# EasyEDA Pro project ProDoc_Board1_2025-04-20.epro, board PCB1
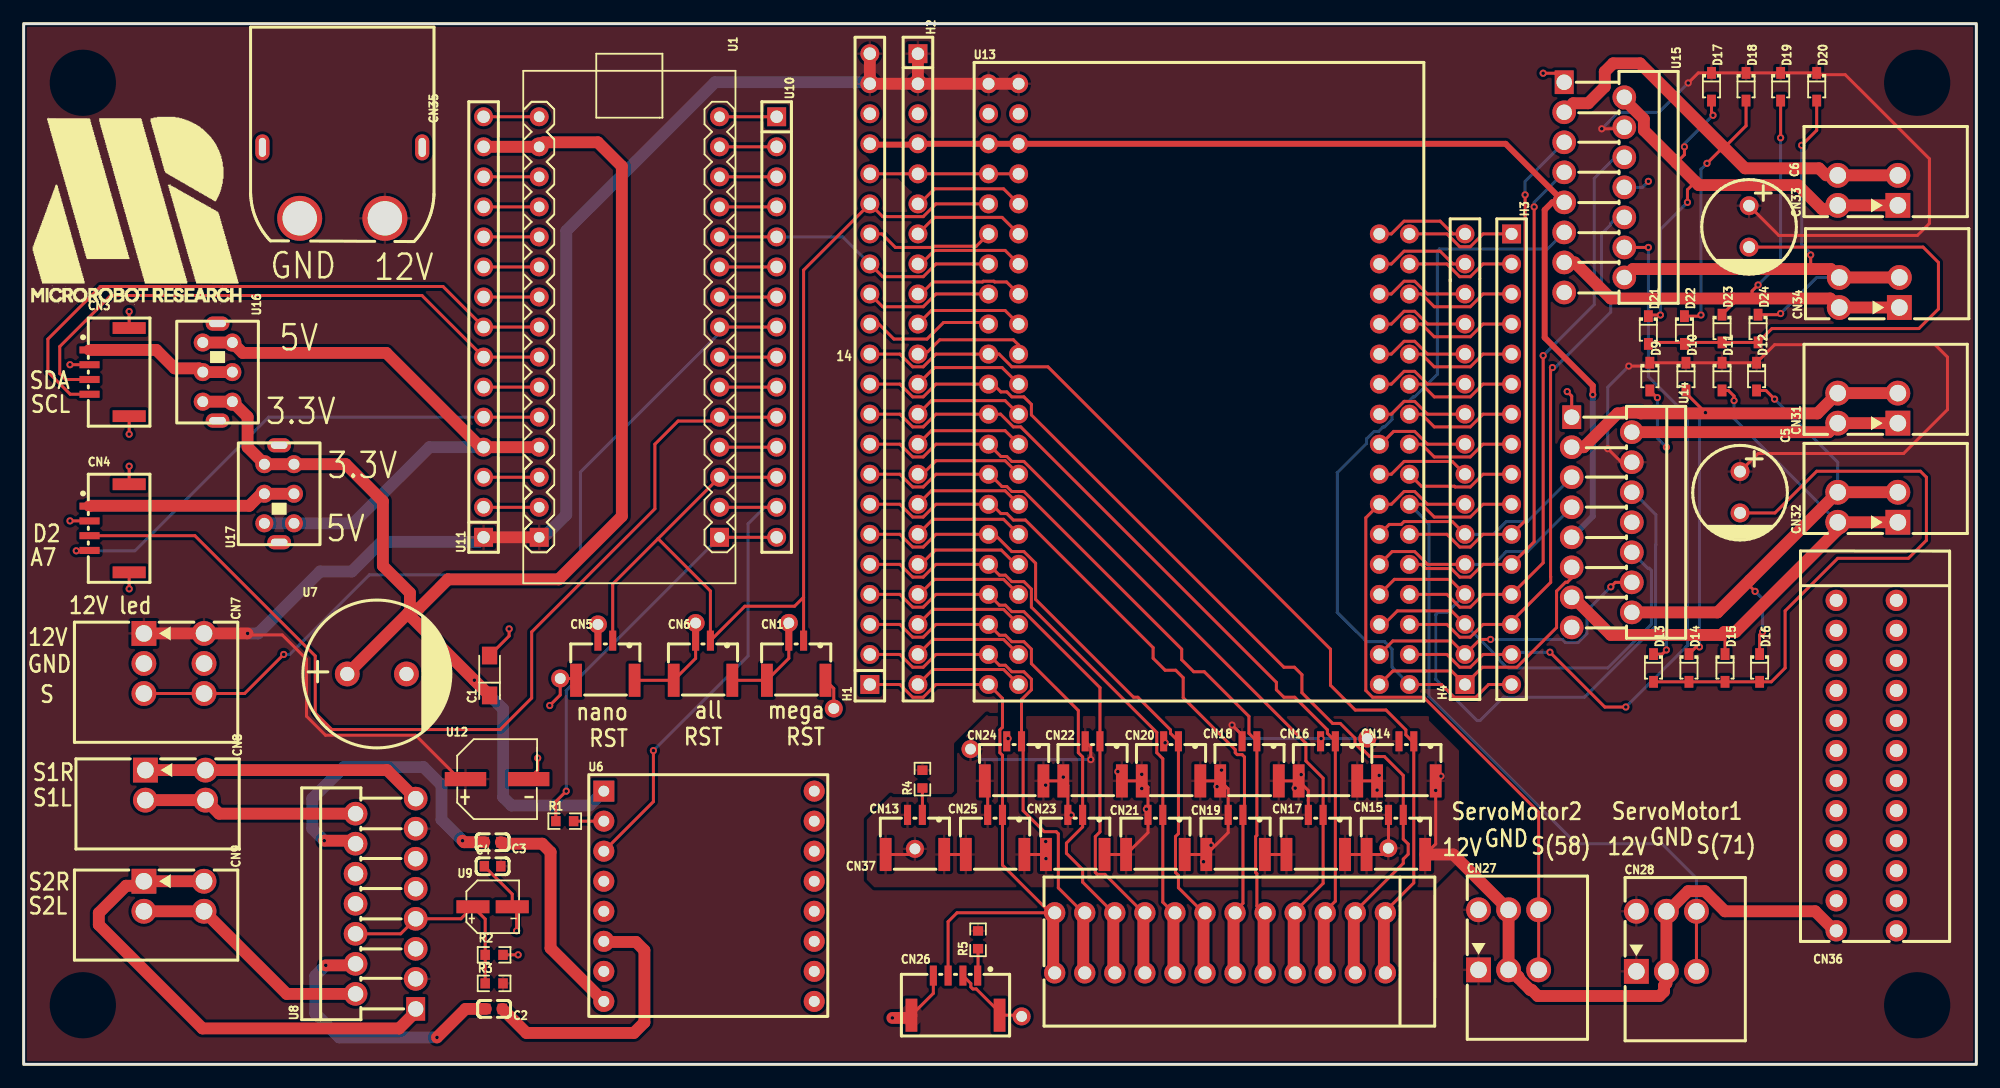
[diagram p2: board, top side]
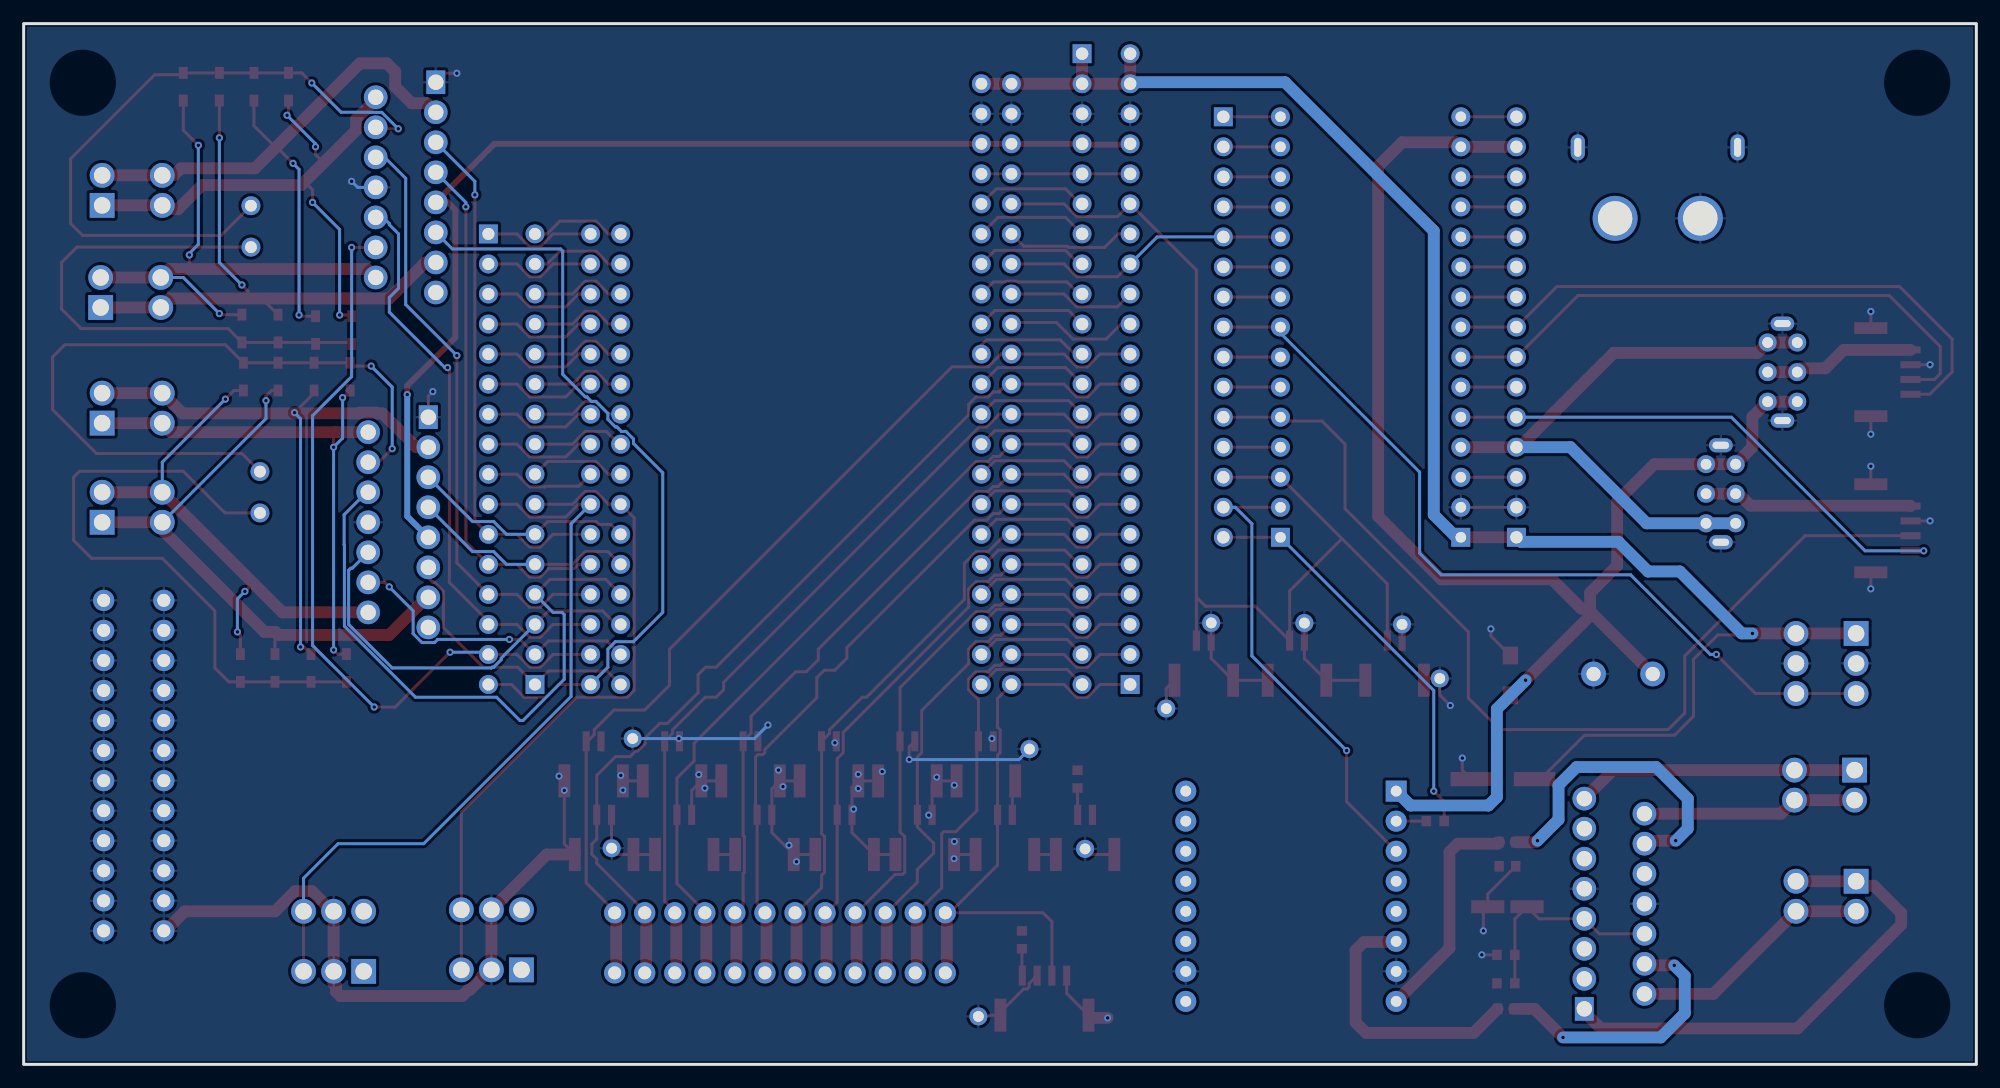
[diagram p3: board, bottom side, seen from below]

Outline 165 x 88 mm; copper layers: Top Layer, Bottom Layer. Coordinates in mm from the lower left corner of the outline.
Outline path: rectangle 0,88 165,0
Stack: Top Layer 0.035mm / Dielectric1 1.51mm FR4 er 4.5 / Bottom Layer 0.035mm

## Design rules (mm)
template: JLCPCB Capability(Two Layers Board)
spacing copperThickness1oz (default): track to track 0.102, other pairs 0.152 to 0.3
spacing copperThickness2oz: track to track 0.203, other pairs 0.152 to 0.3
track width copperThickness1oz (default): min 0.127, default 0.254, max 2.54
track width copperThickness2oz: min 0.203, default 0.254, max 2.54
differential pair differentialPair (default): width min 0.127, default 0.254, max 2.54; gap min 0.152, default 0.152
via viaSize (default): diameter min 0.5, default 0.61, max 10; hole min 0.3, default 0.305, max 6.3

## Placement (name value [footprint] x y rotation side)
C1  100nF  [CAP-SMD_L3.2-W1.6-RD]  39.37 32.88 90 top
C2  220nF  [C0603]  39.75 4.69 180 top
C3  220nF  [C0603]  39.62 18.78 180 top
C4  100nF  [C0603]  39.62 16.75 0 top
C5  220uF  [CAP-TH_BD8.0-P3.50-D0.6-FD]  145.03 48.38 270 top
C6  220uF  [CAP-TH_BD8.0-P3.50-D0.6-FD]  145.8 70.86 270 top
CN3  BM04B-GHS-TBT(LF)(SN)  [CONN-SMD_4P-P1.25_BM04B-GHS-TBT-LF-SN]  7.24 58.54 90 top
CN4  BM04B-GHS-TBT(LF)(SN)  [CONN-SMD_4P-P1.25_BM04B-GHS-TBT-LF-SN]  7.24 45.33 90 top
CN5  BM02B-GHS-TBT(LF)(SN)  [CONN-SMD_2P-P1.25_BM02B-GHS-TBT-LF-SN]  49.15 34.15 0 top
CN6  BM02B-GHS-TBT(LF)(SN)  [CONN-SMD_2P-P1.25_BM02B-GHS-TBT-LF-SN]  57.4 34.15 0 top
CN7  KF141R-2.54-3P  [CONN-TH_3P-P2.54_KF141R-2.54-3P]  12.7 33.9 270 top
CN8  KF141R-2.54-2P  [CONN-TH_2P-P2.54_KF141R-2.54-2P]  12.83 23.61 270 top
CN9  KF141R-2.54-2P  [CONN-TH_2P-P2.54_KF141R-2.54-2P]  12.7 14.21 270 top
CN10  BM02B-GHS-TBT(LF)(SN)  [CONN-SMD_2P-P1.25_BM02B-GHS-TBT-LF-SN]  65.28 34.15 0 top
CN13  BM02B-GHS-TBT(LF)(SN)  [CONN-SMD_2P-P1.25_BM02B-GHS-TBT-LF-SN]  75.31 19.42 0 top
CN14  BM02B-GHS-TBT(LF)(SN)  [CONN-SMD_2P-P1.25_BM02B-GHS-TBT-LF-SN]  116.84 25.64 0 top
CN15  BM02B-GHS-TBT(LF)(SN)  [CONN-SMD_2P-P1.25_BM02B-GHS-TBT-LF-SN]  115.95 19.42 0 top
CN16  BM02B-GHS-TBT(LF)(SN)  [CONN-SMD_2P-P1.25_BM02B-GHS-TBT-LF-SN]  110.21 25.64 0 top
CN17  BM02B-GHS-TBT(LF)(SN)  [CONN-SMD_2P-P1.25_BM02B-GHS-TBT-LF-SN]  109.18 19.42 0 top
CN18  BM02B-GHS-TBT(LF)(SN)  [CONN-SMD_2P-P1.25_BM02B-GHS-TBT-LF-SN]  103.58 25.64 0 top
CN19  BM02B-GHS-TBT(LF)(SN)  [CONN-SMD_2P-P1.25_BM02B-GHS-TBT-LF-SN]  102.4 19.42 0 top
CN20  BM02B-GHS-TBT(LF)(SN)  [CONN-SMD_2P-P1.25_BM02B-GHS-TBT-LF-SN]  96.95 25.64 0 top
CN21  BM02B-GHS-TBT(LF)(SN)  [CONN-SMD_2P-P1.25_BM02B-GHS-TBT-LF-SN]  95.63 19.42 0 top
CN22  BM02B-GHS-TBT(LF)(SN)  [CONN-SMD_2P-P1.25_BM02B-GHS-TBT-LF-SN]  90.32 25.64 0 top
CN23  BM02B-GHS-TBT(LF)(SN)  [CONN-SMD_2P-P1.25_BM02B-GHS-TBT-LF-SN]  88.86 19.42 0 top
CN24  BM02B-GHS-TBT(LF)(SN)  [CONN-SMD_2P-P1.25_BM02B-GHS-TBT-LF-SN]  83.69 25.64 0 top
CN25  BM02B-GHS-TBT(LF)(SN)  [CONN-SMD_2P-P1.25_BM02B-GHS-TBT-LF-SN]  82.08 19.42 0 top
CN26  BM04B-GHS-TBT(LF)(SN)  [CONN-SMD_4P-P1.25_BM04B-GHS-TBT-LF-SN]  78.74 5.83 0 top
CN27  KF141R-2.54-3P  [CONN-TH_3P-P2.54_KF141R-2.54-3P]  125.48 10.53 0 top
CN28  KF141R-2.54-3P  [CONN-TH_3P-P2.54_KF141R-2.54-3P]  138.81 10.4 0 top
CN31  KF141R-2.54-2P  [CONN-TH_2P-P2.54_KF141R-2.54-2P]  155.83 55.49 90 top
CN32  KF141R-2.54-2P  [CONN-TH_2P-P2.54_KF141R-2.54-2P]  155.83 47.11 90 top
CN33  KF141R-2.54-2P  [CONN-TH_2P-P2.54_KF141R-2.54-2P]  155.83 73.9 90 top
CN34  KF141R-2.54-2P  [CONN-TH_2P-P2.54_KF141R-2.54-2P]  155.96 65.27 90 top
CN35  XT60PW-M  [CONN-TH_XT60PW-M]  26.92 74.54 270 top
CN36  DB141R-2.54-12P-GN  [CONN-TH_12P-P2.54_DIBO_DB141R-2.54-12P]  155.7 25.26 90 top
CN37  DB141R-2.54-12P-GN  [CONN-TH_12P-P2.54_DIBO_DB141R-2.54-12P]  101.09 10.28 0 top
D9  1N5819WS  [SOD-323_L1.8-W1.3-LS2.5-RD]  137.41 58.16 270 top
D10  1N5819WS  [SOD-323_L1.8-W1.3-LS2.5-RD]  140.46 58.16 270 top
D11  1N5819WS  [SOD-323_L1.8-W1.3-LS2.5-RD]  143.51 58.16 270 top
D12  1N5819WS  [SOD-323_L1.8-W1.3-LS2.5-RD]  146.43 58.16 270 top
D13  1N5819WS  [SOD-323_L1.8-W1.3-LS2.5-RD]  137.72 33.52 270 top
D14  1N5819WS  [SOD-323_L1.8-W1.3-LS2.5-RD]  140.72 33.52 270 top
D15  1N5819WS  [SOD-323_L1.8-W1.3-LS2.5-RD]  143.76 33.52 270 top
D16  1N5819WS  [SOD-323_L1.8-W1.3-LS2.5-RD]  146.69 33.52 270 top
D17  1N5819WS  [SOD-323_L1.8-W1.3-LS2.5-RD]  142.62 82.67 270 top
D18  1N5819WS  [SOD-323_L1.8-W1.3-LS2.5-RD]  145.54 82.67 270 top
D19  1N5819WS  [SOD-323_L1.8-W1.3-LS2.5-RD]  148.46 82.67 270 top
D20  1N5819WS  [SOD-323_L1.8-W1.3-LS2.5-RD]  151.51 82.67 270 top
D21  1N5819WS  [SOD-323_L1.8-W1.3-LS2.5-RD]  137.29 62.09 270 top
D22  1N5819WS  [SOD-323_L1.8-W1.3-LS2.5-RD]  140.34 62.09 270 top
D23  1N5819WS  [SOD-323_L1.8-W1.3-LS2.5-RD]  143.51 62.22 270 top
D24  1N5819WS  [SOD-323_L1.8-W1.3-LS2.5-RD]  146.56 62.22 270 top
H1  PZ254V-11-22P  [HDR-TH_22P-P2.54-V-M]  71.5 58.79 90 top
H2  PZ254V-11-22P  [HDR-TH_22P-P2.54-V-M]  75.56 58.79 270 top
H3  PZ254V-11-16P  [HDR-TH_PZ254V-11-16P]  125.73 51.17 270 top
H4  PZ254V-11-16P  [HDR-TH_PZ254V-11-16P]  121.79 51.17 90 top
NOREF  -  [Pad_e653]  56.78 37.32 0 top
NOREF#2  -  [Pad_e2172]  75.31 18.22 0 top
NOREF#3  -  [Pad_e2170]  113.54 27.55 0 top
NOREF#4  -  [Pad_e655]  45.34 32.63 0 top
NOREF#5  -  [Pad_e2171]  115.32 18.28 0 top
NOREF#6  -  [Pad_e651]  68.45 30.09 0 top
NOREF#7  -  [Pad_e654]  48.52 37.2 0 top
NOREF#8  -  [Pad_e652]  64.65 37.33 0 top
NOREF#9  -  [Pad_e2168]  80.01 26.66 0 top
NOREF#10  -  [Pad_e2173]  84.33 4.05 0 top
R1  1kF/1608/(1/10W)  [R0603]  45.72 20.56 0 top
R2  47kΩ  [R0603]  39.75 9.26 180 top
R3  47kΩ  [R0603]  39.75 6.85 0 top
R4  10kΩ  [R0603]  75.95 24.12 90 top
R5  10kΩ  [R0603]  80.65 10.53 90 top
U1  ARDUINO_NANO  [COMM-TH_ARDUINO_NANO]  51.18 62.35 270 top
U6  -  [DFplayer]  49.02 23.1 0 top
U7  1000uF  [CAP-TH_BD12.5-P5.00-D0.6-FD]  29.84 33.01 0 top
U8  TDA7297  [MULTIWATT-15_L19.6-W5.0-P1.27-L]  30.58 13.58 90 top
U9  10uF  [CAP-SMD_BD4.0-L4.3-W4.3-LS5.0-FD]  39.62 13.32 0 top
U10  PZ254V-11-15P  [HDR-TH_15P-P2.54-V-M]  63.63 62.35 270 top
U11  PZ254V-11-15P  [HDR-TH_15P-P2.54-V-M]  38.86 62.35 90 top
U12  470uF  [CAP-SMD_BD6.3-L6.6-W6.6-LS7.2-FD]  40 24.12 0 top
U13  ARD_MEGA2560PRO  [COMM-SMD_L54.0-W38.0-P2.54_ARD_MEGA2560PRO]  99.31 57.52 0 top
U14  L298N  [MULTIWATT-15_L19.6-W5.0-P1.27-L]  133.35 45.84 270 top
U15  L298N  [MULTIWATT-15_L19.6-W5.0-P1.27-L]  132.72 74.16 270 top
U16  KH-SS22D07-VG4H  [SW-TH_KH-SS22D07-VG4H]  16.38 58.54 270 top
U17  KH-SS22D07-VG4H  [SW-TH_KH-SS22D07-VG4H]  21.59 48.25 90 top

## Footprints (pads in the part's own frame, mm; a bottom-side part is the same pattern mirrored in y, then rotated)
C0603
  rect 0.8x0.9 smd: 1(-0.7,0) 2(0.7,0)
CAP-SMD_BD4.0-L4.3-W4.3-LS5.0-FD
  rect 2.8x1.1 smd: 1(-1.661,0) 2(1.661,0)
CAP-SMD_BD6.3-L6.6-W6.6-LS7.2-FD
  rect 3.5x1.2 smd: 1(-2.67,0) 2(2.67,0)
CAP-SMD_L3.2-W1.6-RD
  rect 1.5x1.296 smd: 1(-1.687,0) 2(1.687,0)
CAP-TH_BD8.0-P3.50-D0.6-FD
  round 1.6 hole 1: 1(-1.75,0) 2(1.75,0)
CAP-TH_BD12.5-P5.00-D0.6-FD
  round 2.1 hole 1.2: 1(-2.5,0) 2(2.5,0)
COMM-SMD_L54.0-W38.0-P2.54_ARD_MEGA2560PRO
  round 1.6 hole 1: 1(-17.78,25.4) 2(-17.78,22.86) 3(-17.78,20.32) 4(-17.78,17.78) 5(-17.78,15.24) 6(-17.78,12.7) 7(-17.78,10.16) 8(-17.78,7.62) 9(-17.78,5.08) 10(-17.78,2.54) 11(-17.78,0) 12(-17.78,-2.54) 13(-17.78,-5.08) 14(-17.78,-7.62) 15(-17.78,-10.16) 16(-17.78,-12.7) 17(-17.78,-15.24) 18(-17.78,-17.78) 19(-17.78,-20.32) 20(-17.78,-22.86) 21(-17.78,-25.4) 22(-15.24,-25.4) 23(-15.24,-22.86) 24(-15.24,-20.32) 25(-15.24,-17.78) 26(-15.24,-15.24) 27(-15.24,-12.7) 28(-15.24,-10.16) 29(-15.24,-7.62) 30(-15.24,-5.08) 31(-15.24,-2.54) 32(-15.24,0) 33(-15.24,2.54) 34(-15.24,5.08) 35(-15.24,7.62) 36(-15.24,10.16) 37(-15.24,12.7) 38(-15.24,15.24) 39(-15.24,17.78) 40(-15.24,20.32) 41(-15.24,22.86) 42(-15.24,25.4) 49(15.24,12.7) 50(15.24,10.16) 51(15.24,7.62) 52(15.24,5.08) 53(15.24,2.54) 54(15.24,0) 55(15.24,-2.54) 56(15.24,-5.08) 57(15.24,-7.62) 58(15.24,-10.16) 59(15.24,-12.7) 60(15.24,-15.24) 61(15.24,-17.78) 62(15.24,-20.32) 63(15.24,-22.86) 64(15.24,-25.4) 65(17.78,-25.4) 66(17.78,-22.86) 67(17.78,-20.32) 68(17.78,-17.78) 69(17.78,-15.24) 70(17.78,-12.7) 71(17.78,-10.16) 72(17.78,-7.62) 73(17.78,-5.08) 74(17.78,-2.54) 75(17.78,0) 76(17.78,2.54) 77(17.78,5.08) 78(17.78,7.62) 79(17.78,10.16) 80(17.78,12.7)
COMM-TH_ARDUINO_NANO
  rect 1.6x1.6 hole 0.9: 1(17.78,7.62) 30(17.78,-7.62)
  round 1.6 hole 0.9: 2(15.24,7.62) 3(12.7,7.62) 4(10.16,7.62) 5(7.62,7.62) 6(5.08,7.62) 7(2.54,7.62) 8(0,7.62) 9(-2.54,7.62) 10(-5.08,7.62) 11(-7.62,7.62) 12(-10.16,7.62) 13(-12.7,7.62) 14(-15.24,7.62) 15(-17.78,7.62) 16(-17.78,-7.62) 17(-15.24,-7.62) 18(-12.7,-7.62) 19(-10.16,-7.62) 20(-7.62,-7.62) 21(-5.08,-7.62) 22(-2.54,-7.62) 23(0,-7.62) 24(2.54,-7.62) 25(5.08,-7.62) 26(7.62,-7.62) 27(10.16,-7.62) 28(12.7,-7.62) 29(15.24,-7.62)
CONN-SMD_2P-P1.25_BM02B-GHS-TBT-LF-SN
  rect 0.6x1.7 smd: 1(0.625,1.675) 2(-0.625,1.675)
  rect 1x2.8 smd: 3(2.475,-1.675) 4(-2.475,-1.675)
CONN-SMD_4P-P1.25_BM04B-GHS-TBT-LF-SN
  rect 0.6x1.7 smd: 1(1.875,1.675) 2(0.625,1.675) 3(-0.625,1.675) 4(-1.875,1.675)
  rect 1x2.8 smd: 5(3.725,-1.675) 6(-3.725,-1.675)
CONN-TH_2P-P2.54_KF141R-2.54-2P
  round 2.1 hole 1.4: 1(-1.27,2.54) 2(1.27,2.54) 2(1.27,-2.54)
  rect 2.1x2.1 hole 1.4: 1(-1.27,-2.54)
CONN-TH_3P-P2.54_KF141R-2.54-3P
  round 2.1 hole 1.4: 1(-2.54,2.54) 2(0,2.54) 2(0,-2.54) 3(2.54,2.54) 3(2.54,-2.54)
  rect 2.1x2.1 hole 1.4: 1(-2.54,-2.54)
CONN-TH_12P-P2.54_DIBO_DB141R-2.54-12P
  round 1.8 hole 1.1: 1(-13.97,2.54) 1(-13.97,-2.54) 2(-11.43,2.54) 2(-11.43,-2.54) 3(-8.89,2.54) 3(-8.89,-2.54) 4(-6.35,2.54) 4(-6.35,-2.54) 5(-3.81,2.54) 5(-3.81,-2.54) 6(-1.27,2.54) 6(-1.27,-2.54) 7(1.27,2.54) 7(1.27,-2.54) 8(3.81,2.54) 8(3.81,-2.54) 9(6.35,2.54) 9(6.35,-2.54) 10(8.89,2.54) 10(8.89,-2.54) 11(11.43,2.54) 11(11.43,-2.54) 12(13.97,2.54) 12(13.97,-2.54)
CONN-TH_XT60PW-M
  round 3.8 hole 2.9: 1(3,-3.6) 2(3,3.6)
  oval 2.2x1.2 hole 1.6x0.6: 3(-3,6.75) 4(-3,-6.75)
DFplayer
  rect 1.778x1.778 hole 0.914: 1(0,0)
  round 1.778 hole 0.914: 2(0,-2.54) 3(0,-5.08) 4(0,-7.62) 5(0,-10.16) 6(0,-12.7) 7(0,-15.24) 8(0,-17.78) 9(17.78,-17.78) 10(17.78,-15.24) 11(17.78,-12.7) 12(17.78,-10.16) 13(17.78,-7.62) 14(17.78,-5.08) 15(17.78,-2.54) 16(17.78,0)
HDR-TH_15P-P2.54-V-M
  rect 1.6x1.6 hole 1.05: 1(-17.78,0)
  round 1.6 hole 1.05: 2(-15.24,0) 3(-12.7,0) 4(-10.16,0) 5(-7.62,0) 6(-5.08,0) 7(-2.54,0) 8(0,0) 9(2.54,0) 10(5.08,0) 11(7.62,0) 12(10.16,0) 13(12.7,0) 14(15.24,0) 15(17.78,0)
HDR-TH_22P-P2.54-V-M
  rect 1.6x1.6 hole 1.05: 1(-26.67,0)
  round 1.6 hole 1.05: 2(-24.13,0) 3(-21.59,0) 4(-19.05,0) 5(-16.51,0) 6(-13.97,0) 7(-11.43,0) 8(-8.89,0) 9(-6.35,0) 10(-3.81,0) 11(-1.27,0) 12(1.27,0) 13(3.81,0) 14(6.35,0) 15(8.89,0) 16(11.43,0) 17(13.97,0) 18(16.51,0) 19(19.05,0) 20(21.59,0) 21(24.13,0) 22(26.67,0)
HDR-TH_PZ254V-11-16P
  rect 1.6x1.6 hole 1.02: 1(-19.05,0)
  round 1.6 hole 1.02: 2(-16.51,0) 3(-13.97,0) 4(-11.43,0) 5(-8.89,0) 6(-6.35,0) 7(-3.81,0) 8(-1.27,0) 9(1.27,0) 10(3.81,0) 11(6.35,0) 12(8.89,0) 13(11.43,0) 14(13.97,0) 15(16.51,0) 16(19.05,0)
MULTIWATT-15_L19.6-W5.0-P1.27-L
  rect 2x1.6 hole 1.3: 1(-8.89,-2.54)
  round 2 hole 1.3: 2(-7.62,2.54) 3(-6.35,-2.54) 4(-5.08,2.54) 5(-3.81,-2.54) 6(-2.54,2.54) 7(-1.27,-2.54) 8(0,2.54) 9(1.27,-2.54) 10(2.54,2.54) 11(3.81,-2.54) 12(5.08,2.54) 13(6.35,-2.54) 14(7.62,2.54) 15(8.89,-2.54)
Pad_e651
  round 1.524 hole 0.914: 1(0,0)
Pad_e652
  round 1.524 hole 0.914: 2(0,0)
Pad_e653
  round 1.524 hole 0.914: 3(0,0)
Pad_e654
  round 1.524 hole 0.914: 4(0,0)
Pad_e655
  round 1.524 hole 0.914: 5(0,0)
Pad_e2168
  round 1.524 hole 0.914: 1(0,0)
Pad_e2170
  round 1.524 hole 0.914: 3(0,0)
Pad_e2171
  round 1.524 hole 0.914: 4(0,0)
Pad_e2172
  round 1.524 hole 0.914: 5(0,0)
Pad_e2173
  round 1.524 hole 0.914: 6(0,0)
R0603
  rect 0.806x0.864 smd: 1(-0.753,0) 2(0.753,0)
SOD-323_L1.8-W1.3-LS2.5-RD
  rect 1x0.75 smd: 1(-1.173,0) 2(1.173,0)
SW-TH_KH-SS22D07-VG4H
  round 1.524 hole 0.914: 1(-2.5,-1.25) 2(0,-1.25) 3(2.5,-1.25) 4(-2.5,1.25) 5(0,1.25) 6(2.5,1.25)
  oval 1.2x2 hole 0.6x1.4: 7(4.1,0) 8(-4.1,0)

## Nets
As in the schematic, except:
GND: C1.2 C4.1 CN3.2 CN3.5 CN3.6 CN4.2 CN4.5 CN4.6 CN5.2 CN5.3 CN5.4 CN6.2 CN6.3 CN6.4 CN7.2 CN10.2 CN10.3 CN10.4 CN13.2 CN13.3 CN13.4 CN14.2 CN14.3 CN14.4 CN15.2 CN15.3 CN15.4 CN16.2 CN16.3 CN16.4 CN17.2 CN17.3 CN17.4 CN18.2 CN18.3 CN18.4 CN19.2 CN19.3 CN19.4 CN20.2 CN20.3 CN20.4 CN21.2 CN21.3 CN21.4 CN22.2 CN22.3 CN22.4 CN23.2 CN23.3 CN23.4 CN24.2 CN24.3 CN24.4 CN25.2 CN25.3 CN25.4 CN26.2 CN26.4 CN26.5 CN26.6 CN27.2 CN28.2 CN35.1 CN35.3 CN35.4 CN36.1 CN36.2 CN36.3 CN36.4 CN36.5 CN36.6 CN36.7 CN36.8 CN36.9 CN36.10 CN36.11 CN36.12 H1.20 H2.3 NOREF.3 NOREF#2.5 NOREF#3.3 NOREF#4.5 NOREF#5.4 NOREF#6.1 NOREF#7.4 NOREF#8.2 NOREF#9.1 NOREF#10.6 R2.1 U1.29 U6.7 U6.10 U7.2 U8.8 U8.9 U9.2 U11.2 U12.2 U13.2 U13.41 U14.1 U14.8 U15.1 U15.8 U16.7 U16.8 U17.7 U17.8

Pads without a net: U6 4 5 9 11 12 13 14 15 16; U8 5 10 11; U14 15; U15 15

## Via types
v1: diameter 0.61, hole 0.305, Top Layer to Bottom Layer, 83 vias

## Routing (per net, layer and track width the routed paths; a pad name or vN(x,y) marks a point on that pad's centre or on a via; arc(x,y) is an arc through that point)
+3.3V: length 131.1
  Top Layer w1: C1.1 v1(38.08,32.48) 32.49,38.07 32.49,38.16 ; U16.3 U16.6 18.92,54.75 18.92,52.19 20.36,50.75 U17.3 27.22,50.75 30.35,47.61 30.35,42.15 32.64,39.87 32.64,38.72 ; 32.49,38.16 U7.1 ; 32.49,38.16 32.88,38.54 33.38,38.54 35.85,41.01 45.21,41.01 50.55,46.34 50.55,75.94 48.51,77.97 43.94,77.97 U1.17 U11.14
  Bottom Layer w1: U6.1 47.81,21.89 41.22,21.89 40.51,22.59 40.51,30.05 v1(38.08,32.48)
+5V: length 146
  Top Layer w0.5: 71.57,77.77 75.5,77.77 H2.4 U13.3 U13.40 125.22,77.84 U15.9 129.16,72.89 128.52,72.25 128.52,61.46 132.59,57.39 v1(132.59,56.63)
  Top Layer w1: U16.1 U16.4 18.51,60.16 30.64,60.16 38.61,52.19 U11.4 U1.27
  Bottom Layer w0.5: v1(132.59,56.63) 132.59,46.34 U14.9
  Bottom Layer w1: U11.4 34.29,52.19 27.85,45.75 U17.1 U17.4
GND: length 206.3
  Top Layer w0.254: CN15.3 119.31,18.63 v1(119.31,23.16) CN14.3 ; 108.55,21.09 108.55,23.15 CN16.4 CN18.3 ; CN25.4 CN13.3 ; CN22.2 90.17,26.85 v1(90.17,25.77) ; U15.1 129.41,83.81 v1(128.4,83.81) ; CN5.3 CN6.4 56.78,34.33 CN6.2 NOREF.3 56.77,37.33 ; CN14.4 CN16.3 ; R2.1 v1(41.78,9.26) ; v1(41.66,11.29) 41.66,12.95 U9.2 41.28,14.39 C4.1 ; NOREF#10.6 84.22,4.16 CN26.5 82.47,4.41 80.49,6.38 80.2,6.38 80.04,6.54 80.04,6.84 CN26.2 ; CN17.4 CN19.3 ; v1(44.45,30.34) 45.34,31.23 NOREF#4.5 46.52,32.63 CN5.4 ; CN23.4 CN25.3 ; CN19.4 101.78,19.6 101.78,23.29 CN18.4 CN20.3 ; CN18.2 102.96,27.84 v1(102.11,28.69) ; CN21.3 99.93,17.75 ; CN24.3 CN22.4 88.23,23.58 88.23,21.09 ; NOREF#6.1 68.45,31.78 CN10.3 ; CN4.2 v1(3.91,45.95) ; NOREF#8.2 CN10.2 64.65,34.33 CN10.4 CN6.3 ; CN22.3 CN20.4 95.01,23.44 95.01,19.6 CN21.4 CN23.3 ; v1(43.43,25.9) 43.43,24.88 U12.2 ; C1.2 41.02,36.22 v1(41.02,36.82) ; CN5.2 NOREF#7.4 ; CN26.4 76.87,6.01 CN26.6 ; CN13.4 74.84,17.75 NOREF#2.5 ; U14.1 130.81,56.5 v1(130.43,56.89) ; CN24.4 81.46,23.73 81.46,21.09 ; CN3.5 v1(8.91,63.66) ; CN3.2 v1(3.91,59.16) ; CN3.6 v1(8.91,53.29) ; CN4.6 v1(8.91,40.21) ; 115.33,21.09 115.33,18.29 NOREF#5.4 114.78,17.75 CN15.4 CN17.3 ; CN4.5 v1(8.91,50.58) ; U11.2 U1.29
  Top Layer w1: CN15.3 120.8,17.75 CN27.2 CN27.2 125.73,7.99 126.31,7.41 126.31,7.28 127.31,6.29 127.43,6.29 127.94,5.78 138.23,5.78 138.61,6.16 138.61,6.64 138.81,6.85 CN28.2 138.81,12.94 138.94,12.94 140.65,14.65 142.06,14.65 143.76,12.94 151.38,12.94 153.16,11.16 ; CN26.6 74.78,3.93 v1(73.41,3.93)
  Bottom Layer w0.254: NOREF#3.3 v1(109.63,27.55) 103.25,27.55 v1(102.11,28.69) ; v1(90.17,25.77) 80.9,25.77 NOREF#9.1 ; v1(137.29,74.67) 136.78,74.16 U15.8
  vias: v1(83.19,27.55) v1(86.36,23.61) v1(86.36,18.84) v1(86.38,17.39) v1(87.85,24.29) v1(88.52,21.07) v1(92.46,24.75) v1(94.48,24.52) v1(94.48,23.32) v1(94.87,21.58) v1(96.45,27.19) v1(99.69,17.13) v1(100.33,18.53) v1(100.84,23.48) v1(101.22,24.88) v1(107.44,23.36) v1(107.95,24.5) v1(114.37,23.19) v1(114.54,24.43) v1(119.76,24.37)
VCC: length 258
  Top Layer w0.254: U14.4 135,50.92 v1(133.86,52.06) ; v1(18.92,36.44) 19.05,36.31 21.85,36.31 23.9,34.26 23.9,29.43 25.51,27.83 33.12,27.83 36.83,24.12 U12.1 ; C5.1 146.56,51.65 158.85,51.65 162.56,55.36 162.56,59.81 161.51,60.85 147.96,60.85 D12.1 D11.1 D10.1 D9.1 137.13,59.04 v1(135.64,59.04) ; v1(133.35,79.11) 135.13,79.11 U15.4 ; v1(140.65,82.98) 141.51,83.84 D17.1 D18.1 D19.1 D20.1 151.67,83.68 153.92,83.68 161.04,76.57 161.04,71.11 160.02,70.09 148.31,70.09 C6.1
  Top Layer w1: H2.1 H2.2 ; H2.2 U13.1 U13.42 ; H2.2 H1.21 H1.22 ; U11.1 U1.30 ; v1(18.92,36.44) CN7.1 CN7.1
  Bottom Layer w0.254: v1(133.35,79.11) 134.74,80.5 135.78,80.5 135.79,80.51 138.18,80.51 v1(140.65,82.98) ; v1(133.86,52.06) 133.86,57.27 v1(135.64,59.04)
  Bottom Layer w1: U11.1 38.48,44.19 30.24,44.19 27.73,41.68 25.05,41.68 19.81,36.44 v1(18.92,36.44) ; H1.21 71.37,83.05 58.42,83.05 45.85,70.47 45.85,46.47 43.94,44.57 U1.30
D1_A: length 44.5
  Top Layer w0.254: U13.70 120.27,44.82 121.35,43.74 122.24,43.74 123.32,44.82 H3.11 126.87,45.96 v1(126.87,73.52)
  Bottom Layer w0.254: U15.5 126.87,74.67 v1(126.87,73.52)
D1_B: length 44.5
  Top Layer w0.254: v1(127.63,72.51) 127.63,44.19 H3.12 123.32,42.28 122.24,41.2 121.35,41.2 120.62,41.92 118.47,41.92 118.12,42.28 U13.69
  Bottom Layer w0.254: 130.18,75.43 127.63,72.89 v1(127.63,72.51)
D1_S: length 50.9
  Top Layer w0.254: v1(128.4,59.93) 128.4,42.41 H3.13 123.32,39.74 122.24,38.66 121.35,38.66 120.27,39.74 U13.68
  Bottom Layer w0.254: v1(128.4,59.93) 132.72,64.25 132.72,74.92 134.49,76.7 U15.6
D2_A: length 49.2
  Top Layer w0.254: v1(129.18,58.92) 129.02,58.76 129.02,41.24 129.03,41.23 129.03,40.76 125.73,37.45 H3.14 123.32,37.2 122.24,36.12 121.35,36.12 120.27,37.2 U13.67
  Bottom Layer w0.254: U15.10 135.13,71.74 134.75,71.74 134.1,71.1 134.1,71 133.32,70.23 133.32,65.62 134.1,64.84 134.1,63.61 129.41,58.92 v1(129.18,58.92)
D2_B: length 65.6
  Top Layer w0.254: H3.15 123.32,34.66 122.24,33.58 121.35,33.58 120.27,34.66 U13.66 ; v1(128.97,34.85) 133.6,30.22 v1(135.38,30.22) ; U15.12 v1(137.29,69.08)
  Bottom Layer w0.254: v1(128.97,34.85) 125.92,34.85 H3.15 ; v1(135.38,30.22) 140.59,35.42 140.59,54.85 137.29,58.16 v1(137.29,69.08)
D2_S: length 65.1
  Top Layer w0.254: H3.16 123.79,32.12 122.71,31.04 120.88,31.04 119.8,32.12 U13.65
  Bottom Layer w0.254: U13.65 115.63,33.58 115.63,35.11 115,35.74 113.47,35.74 111,38.22 111,50.03 113.47,52.5 113.47,52.89 114.11,53.52 114.49,53.52 114.87,53.9 115,53.9 115.63,54.53 115.63,55.05 116.65,56.06 117.03,56.06 117.41,56.44 117.54,56.44 119.45,58.35 119.45,68.77 119.63,68.95 128.78,68.95 U15.11
D3_A: length 19.1
  Top Layer w0.254: H4.6 120.71,45.9 116.65,45.9 116.41,45.66 115.39,45.66 U13.59
  Bottom Layer w0.254: U14.5 127.06,45.9 125.28,45.9 124.2,44.82 H4.6
D3_B: length 19.1
  Top Layer w0.254: U13.60 115.63,43.36 117.54,43.36 118.62,42.28 H4.5
  Bottom Layer w0.254: U14.7 127.06,43.36 125.28,43.36 124.2,42.28 H4.5
D3_S: length 52.5
  Top Layer w0.254: U13.61 115.82,41.01 120.52,41.01 H4.4
  Bottom Layer w0.254: U14.6 136.02,48.38 137.92,46.47 137.92,43.93 137.9,43.91 137.9,37.05 131.89,31.04 125.03,31.04 123.06,29.07 122.81,29.07 119.33,32.55 119.33,38.04 119.51,38.22 120.27,38.22 H4.4
D4_A: length 33.9
  Top Layer w0.254: U13.62 114.94,37.2 116.08,38.34 120.65,38.34 H4.3
  Bottom Layer w0.254: H4.3 124.65,34.34 124.65,34.21 125.28,33.58 125.41,33.58 125.48,33.52 133.86,33.52 137.54,37.2 137.54,41.77 137.36,41.95 137.23,41.95 U14.10
D4_B: length 26.2
  Top Layer w0.254: U13.63 115.7,35.8 120.65,35.8 H4.2 123.06,35.93 v1(123.95,35.93) ; v1(134.11,40.38) 134.49,40.76 U14.12
  Bottom Layer w0.254: v1(134.11,40.38) 132.09,38.35 132.09,36.42 131.34,35.67 130.28,35.67 130.02,35.93 v1(123.95,35.93)
D4_S: length 23.6
  Top Layer w0.254: U14.11 130.81,41.14 130.44,40.77 130.28,40.77 129.53,40.02 129.53,36.94 126.18,33.58 123.25,33.58 H4.1 120.65,33.26 115.7,33.26 U13.64
NET1: length 83.1
  Top Layer w0.254: 114.94,12.82 117.47,15.35 CN14.1 117.34,27.32 116.79,27.86 116.79,28.28 115.12,29.96 112.52,29.96 111.8,30.69 ; H1.12 74.04,60.06 75.12,58.98 76.01,58.98 77.09,60.06 U13.10 82.42,60.06 83.5,58.98 86.55,58.98 110.43,35.11 110.43,32.06 111.8,30.69
  Top Layer w1: 114.94,12.82 114.94,7.74
NET2: length 80.1
  Top Layer w0.254: 112.4,12.82 116.58,17 116.58,17.35 116.99,17.77 116.99,18.63 116.58,19.05 116.58,24.43 114.98,26.03 113.75,26.03 113.27,26.51 113.11,26.51 112.5,27.12 112.5,27.58 111.25,28.83 110.61,28.83 108.01,31.42 108.01,32.95 107.38,33.58 106.49,33.58 85.15,54.91 85.15,55.81 84.52,56.44 83.5,56.44 83.08,56.86 82.57,56.86 81.91,57.52 U13.11 77.09,57.52 76.01,56.44 75.12,56.44 74.04,57.52 H1.11
  Top Layer w1: 112.4,12.82 112.4,7.74
NET3: length 72.2
  Top Layer w0.254: 109.85,12.82 110.84,13.8 CN16.1 110.16,27.99 110.16,28.28 107.41,31.04 106.49,31.04 105.85,31.67 105.85,32.3 84.25,53.9 83.63,53.9 82.55,54.98 U13.12 77.09,54.98 76.01,53.9 75.12,53.9 74.04,54.98 H1.10
  Top Layer w1: 109.85,12.82 109.85,7.74
NET4: length 69.3
  Top Layer w0.254: H1.9 74.04,52.44 75.12,51.36 76.01,51.36 77.09,52.44 U13.13 82.57,51.4 83.08,51.4 83.5,50.98 84.52,50.98 108.35,27.15 108.35,25.65 109.8,24.2 109.8,15.3 107.31,12.82
  Top Layer w1: 107.31,12.82 107.31,7.74
NET5: length 64.2
  Top Layer w0.254: H1.8 74.04,49.9 75.12,48.82 76.01,48.82 77.09,49.9 U13.14 81.62,49.9 82.67,48.86 83.08,48.86 83.5,48.44 84.52,48.44 97.85,35.11 97.85,34.21 98.87,33.2 99.76,33.2 103.54,29.42 103.54,27.99 CN18.1 104.21,19.37 104.1,19.26 104.1,16.23 104.21,16.12 104.21,13.38 104.78,12.82
  Top Layer w1: 104.78,12.82 104.78,7.74
NET6: length 61.7
  Top Layer w0.254: 102.24,12.82 103.03,13.61 103.03,21.09 103.16,21.22 103.16,25.99 102.96,26.19 102.54,26.19 102.38,26.35 102.38,26.61 97.98,31 97.98,32.69 97.35,33.33 96.45,33.33 95.44,34.34 95.44,35.23 84.65,46.03 83.63,46.03 83.08,46.57 82.57,46.57 81.79,47.36 U13.15 77.09,47.36 76.01,46.28 75.12,46.28 74.04,47.36 H1.7
  Top Layer w1: 102.24,12.82 102.24,7.74
NET7: length 56.8
  Top Layer w0.254: 99.69,12.82 97.58,14.93 97.58,15.98 97.33,16.23 97.33,19.26 97.58,19.51 CN20.1 96.91,27.99 96.91,28.28 94.15,31.04 93.79,31.04 85.51,39.32 85.51,42.37 84.52,43.36 83.5,43.36 82.04,44.82 U13.16 77.09,44.82 76.01,43.74 75.12,43.74 74.04,44.82 H1.6
  Top Layer w1: 99.69,12.82 99.69,7.74
NET8: length 52.8
  Top Layer w0.254: H1.5 74.04,42.28 75.12,41.2 76.01,41.2 77.09,42.28 U13.17 82.45,41.37 82.95,41.37 83.5,40.82 84.52,40.82 85.15,40.19 85.15,38.66 95.75,28.07 95.75,26.35 96.26,25.84 96.26,13.72 97.16,12.82
  Top Layer w1: 97.16,12.82 97.16,7.74
NET9: length 49.9
  Top Layer w0.254: 94.62,12.82 91.37,16.07 90.72,16.07 90.55,16.23 90.55,19.26 90.95,19.65 CN22.1 90.95,31.85 84.52,38.28 83.5,38.28 82.95,38.83 82.45,38.83 U13.18 77.09,39.74 76.01,38.66 75.12,38.66 74.04,39.74 H1.4
  Top Layer w1: 94.62,12.82 94.62,7.74
NET10: length 46.8
  Top Layer w0.254: H1.3 74.04,37.2 75.12,36.12 76.01,36.12 77.09,37.2 U13.19 82.45,36.29 82.95,36.29 83.5,35.74 84.52,35.74 85.15,35.11 85.15,33.89 89.12,29.92 89.12,26.35 89.48,25.99 89.48,20.08 88.11,18.71 88.11,17.85 89.48,16.48 89.48,15.41 92.07,12.82
  Top Layer w1: 92.07,12.82 92.07,7.74
NET11: length 43.3
  Top Layer w0.254: 89.53,12.82 87.43,14.92 87.43,19.49 87.25,19.67 86.23,19.67 84.46,21.45 84.46,27.18 CN24.1 84.32,30.84 85.15,31.67 85.15,32.57 84.52,33.2 83.5,33.2 82.95,33.75 82.45,33.75 U13.20 77.09,34.66 76.01,33.58 75.12,33.58 74.04,34.66 H1.2
  Top Layer w1: 89.53,12.82 89.53,7.74
NET12: length 51
  Top Layer w0.254: 86.49,13.07 82.71,16.85 82.71,26.13 82.49,26.35 82.49,28.28 82.71,28.5 82.71,30.94 U13.21 77.09,32.12 76.01,31.04 75.12,31.04 74.04,32.12 H1.1 ; CN26.3 78.12,12.06 78.87,12.82 86.49,12.82 ; 86.69,12.82 87,12.82
  Top Layer w1: 86.69,12.82 87,12.52 87,7.74
RST_MEGA: length 92.4
  Top Layer w0.254: U10.13 U1.3 53.6,44.45 ; U13.5 77.09,72.76 76.01,71.68 72.58,71.68 H1.17 65.9,67.16 65.9,39.5 ; 53.6,44.45 58.03,40.03 CN6.1 60.94,38.74 65.14,38.74 65.9,39.5 ; 53.6,44.45 49.77,40.62 CN5.1 ; CN10.1 65.9,39.5
S1: length 63.3
  Top Layer w0.254: U13.71 118.12,47.36 119.2,46.28 122.24,46.28 123.32,47.36 H3.10 ; CN28.3 141.35,12.94
  Bottom Layer w0.254: 141.35,12.94 141.35,15.74 138.43,18.66 131.19,18.66 118.75,31.1 118.75,45.71 U13.71
S2: length 56.6
  Top Layer w0.254: CN27.3 CN27.3 128.02,21.33 118.3,31.04 113.98,31.04 113.41,31.61 113.41,46.22 U13.58 115.57,47.36 116.65,48.44 117.54,48.44 118.62,47.36 H4.7
TRIGGER: length 24.6
  Top Layer w0.254: U10.5 U1.11 ; H1.15 72.58,66.6 76.01,66.6 77.09,67.68 U13.7
  Bottom Layer w0.254: U10.5 69.22,69.97 H1.15
$1N1361: length 4.7
  Top Layer w0.254: U1.28 U11.3
$1N1386: length 44.9
  Top Layer w0.254: CN4.4 4.48,43.45 v1(4.44,43.42) ; U11.5 U1.26
  Bottom Layer w0.254: U11.5 20.7,54.73 9.4,43.42 v1(4.44,43.42)
$1N1390: length 4.7
  Top Layer w0.254: U1.25 U11.6
$1N1395: length 49.5
  Top Layer w0.254: U1.24 U11.7 33.66,65.01 7.37,65.01 3.05,60.69 3.05,58.41 3.55,57.91 CN3.3
$1N1400: length 51.9
  Top Layer w0.254: U1.23 U11.8 35.43,65.78 6.49,65.78 2.05,61.33 2.05,58.55 3.94,56.66 CN3.4
$1N1405: length 4.7
  Top Layer w0.254: U11.9 U1.22
$1N1410: length 4.7
  Top Layer w0.254: U1.21 U11.10
$1N1415: length 4.7
  Top Layer w0.254: U1.20 U11.11
$1N1420: length 4.7
  Top Layer w0.254: U11.12 U1.19
$1N1425: length 4.7
  Top Layer w0.254: U1.18 U11.13
$1N1435: length 4.7
  Top Layer w0.254: U1.16 U11.15
$1N1440: length 4.8
  Top Layer w0.254: U1.15 U10.1
$1N1445: length 4.8
  Top Layer w0.254: U10.2 U1.14
$1N1450: length 4.8
  Top Layer w0.254: U1.13 U10.3
$1N1455: length 4.8
  Top Layer w0.254: U10.4 U1.12
$1N1468: length 4.8
  Top Layer w0.254: U1.10 U10.6
$1N1472: length 4.8
  Top Layer w0.254: U10.7 U1.9
$1N1477: length 70.6
  Top Layer w0.254: CN7.3 CN7.3 18.67,31.36 v1(21.97,34.66) ; U1.8 U10.8
  Bottom Layer w0.254: U1.8 58.8,61.84 47.04,50.08 47.04,43.22 45.21,41.39 29.21,41.39 22.48,34.66 v1(21.97,34.66)
$1N1482: length 4.8
  Top Layer w0.254: U10.9 U1.7
$1N1487: length 4.8
  Top Layer w0.254: U10.10 U1.6
$1N1492: length 85.1
  Top Layer w0.254: CN4.3 14.47,44.7 24.64,34.53 24.64,29.71 26.03,28.31 40.26,28.31 42.93,30.98 42.93,36.56 53.34,46.98 53.34,52.44 55.3,54.4 58.47,54.4 U1.5 U10.11
$1N1497: length 4.8
  Top Layer w0.254: U10.12 U1.4
$1N1507: length 40.6
  Top Layer w0.254: U10.14 U1.2 ; v1(53.21,26.53) 53.21,22.21 U6.3
  Bottom Layer w0.254: v1(53.21,26.53) 61.21,34.53 61.21,45.71 62.61,47.11 U10.14
$1N1512: length 34.6
  Top Layer w0.254: U1.1 U10.15 ; R1.1 44.97,22.22 v1(45.85,23.1)
  Bottom Layer w0.254: U1.1 45.85,31.61 v1(45.85,23.1)
$1N1909: length 12.8
  Top Layer w1: CN3.1 11.21,60.41 12.77,58.85 14.82,58.85 U16.2 U16.5
$1N2904: length 2.5
  Top Layer w0.254: R1.2 49.02,20.56
$1N3581: length 23.1
  Top Layer w1: U6.6 49.08,10.35 51.74,10.35 52.45,9.64 52.45,3.54 51.56,2.66 42.48,2.66 C2.1
$1N3694: length 23.3
  Top Layer w1: C2.2 37.34,4.69 v1(34.92,2.28) ; U8.4 27.92,8.37 v1(25.53,8.37)
  Bottom Layer w1: v1(25.53,8.37) 24.64,7.48 24.64,4.31 26.67,2.28 v1(34.92,2.28)
$1N3698: length 26.7
  Top Layer w1: C3.2 37.21,18.78 v1(37.08,18.91) ; U8.12 27.79,18.91 v1(25.4,18.91)
  Bottom Layer w1: v1(25.4,18.91) 24.38,19.93 24.38,22.47 27.05,25.14 33.78,25.14 35.31,23.61 35.31,20.69 v1(37.08,18.91)
$1N3703: length 19
  Top Layer w1: C3.1 40.45,18.66 43.81,18.66 44.52,17.95 44.52,9.82 49.02,5.32
$1N3844: length 23.8
  Top Layer w1: U8.15 30.71,24.88 CN8.1 10.29,24.88
$1N3849: length 18.2
  Top Layer w1: 10.29,22.34 15.37,22.34 16.51,21.2 U8.14
$1N3859: length 20.8
  Top Layer w1: U8.2 22.22,5.96 15.24,12.94 10.16,12.94
$1N3866: length 42.7
  Top Layer w1: CN9.1 CN9.1 ; 10.41,15.1 8.65,15.1 6.35,12.8 6.35,11.8 15.11,3.04 31.73,3.04 33.12,4.43 U8.1 32.87,4.94
$1N3872: length 17.8
  Top Layer w0.254: R3.1 R2.2 39,12.29 U9.1 36.95,12.31 U8.7 31.86,11.04 U8.6
$1N7236: length 17.7
  Top Layer w1: U17.2 U17.5 20.09,48.25 19.07,47.23 5.59,47.23 CN4.1
$2N2143: length 12.6
  Top Layer w0.254: U13.39 U13.4 H2.5 H1.18
$2N2148: length 11
  Top Layer w0.254: H1.16 72.52,70.22 73.66,69.08 76.71,69.08 76.81,69.18 80.49,69.18 U13.6
$2N2156: length 10.9
  Top Layer w0.254: H1.14 72.58,64.06 76.01,64.06 77.09,65.14 U13.8
$2N2160: length 11.3
  Top Layer w0.254: U13.9 81.41,62.73 77.73,62.73 76.33,61.33 73.53,61.33 72.14,62.73 71.63,62.73 H1.13
$2N2235: length 9.6
  Top Layer w0.254: U13.22 82.8,33.39 76.84,33.39 H2.22
$2N2239: length 9.6
  Top Layer w0.254: H2.21 76.84,35.93 82.8,35.93 U13.23
$2N2244: length 9.6
  Top Layer w0.254: U13.24 82.8,38.47 76.84,38.47 H2.20
$2N2249: length 9.6
  Top Layer w0.254: H2.19 75.69,39.74 76.96,41.01 82.8,41.01 U13.25
$2N2254: length 9.5
  Top Layer w0.254: U13.26 83.82,42.28 82.61,43.49 77.03,43.49 75.82,42.28 H2.18
$2N2259: length 9.6
  Top Layer w0.254: H2.17 76.84,46.09 82.8,46.09 U13.27
$2N2264: length 9.5
  Top Layer w0.254: H2.16 76.71,48.5 82.93,48.5 U13.28
$2N2296: length 9.6
  Top Layer w0.254: H2.6 75.69,72.76 76.96,74.03 82.8,74.03 U13.38
$2N2301: length 9.7
  Top Layer w0.254: U13.37 82.68,71.62 76.96,71.62 H2.7
$2N2306: length 9.5
  Top Layer w0.254: U13.36 82.93,68.82 76.96,68.82 75.82,67.68 H2.8
$2N2311: length 9.4
  Top Layer w0.254: U13.35 83.06,66.16 82.04,66.16 81.98,66.22 81.09,66.22 81.02,66.16 76.84,66.16 75.82,65.14 H2.9
$2N2316: length 9.5
  Top Layer w0.254: U13.34 82.93,63.74 76.71,63.74 H2.10
$2N2321: length 10
  Top Layer w0.254: H2.11 75.76,60.25 76.39,60.25 77.41,61.27 83.63,61.27 84.07,60.82 U13.33
$2N2326: length 9.7
  Top Layer w0.254: H2.12 76.96,58.92 82.68,58.92 U13.32
$2N2337: length 9.5
  Top Layer w0.254: H2.14 76.71,53.58 82.93,53.58 U13.30
$2N2341: length 9.5
  Top Layer w0.254: H2.13 76.71,56.12 82.93,56.12 U13.31
$2N2346: length 9.5
  Top Layer w0.254: H2.15 75.95,49.9 77.09,51.04 82.93,51.04 U13.29
$2N2352: length 8.1
  Top Layer w0.254: H4.16 120.77,70.22 119.69,71.3 116.65,71.3 115.57,70.22 U13.49
$2N2354: length 8.1
  Top Layer w0.254: H4.15 120.77,67.68 119.69,68.76 116.65,68.76 115.57,67.68 U13.50
$2N2356: length 8.1
  Top Layer w0.254: U13.51 115.57,65.14 116.65,66.22 117.54,66.22 118.62,65.14 H4.14
$2N2358: length 8.1
  Top Layer w0.254: H4.13 118.62,62.6 117.54,63.68 116.65,63.68 115.57,62.6 U13.52
$2N2360: length 8.1
  Top Layer w0.254: H4.12 118.62,60.06 117.54,61.14 116.65,61.14 115.57,60.06 U13.53
$2N2362: length 8.1
  Top Layer w0.254: U13.54 115.57,57.52 116.65,58.6 117.54,58.6 118.62,57.52 H4.11
$2N2364: length 8.1
  Top Layer w0.254: U13.55 115.57,54.98 116.65,56.06 117.54,56.06 118.62,54.98 H4.10
$2N2366: length 8.1
  Top Layer w0.254: U13.56 114.68,52.44 115.76,53.52 117.54,53.52 118.62,52.44 H4.9
$2N2368: length 8.1
  Top Layer w0.254: U13.57 115.57,49.9 116.65,50.98 120.71,50.98 H4.8
$2N2398: length 9.5
  Top Layer w0.254: U13.72 118.11,48.88 120.9,48.88 120.97,48.82 122.24,48.82 123.32,49.9 H3.9
$2N2400: length 9.5
  Top Layer w0.254: H3.8 123.32,52.44 122.24,51.36 119.2,51.36 118.12,52.44 U13.73
$2N2402: length 9.5
  Top Layer w0.254: H3.7 123.32,54.98 122.24,53.9 119.2,53.9 118.12,54.98 U13.74
$2N2404: length 9.5
  Top Layer w0.254: U13.75 118.12,57.52 119.2,56.44 122.24,56.44 123.32,57.52 H3.6
$2N2406: length 9.5
  Top Layer w0.254: U13.76 118.12,60.06 119.2,58.98 122.24,58.98 123.32,60.06 H3.5
$2N2408: length 9.5
  Top Layer w0.254: U13.77 118.12,62.6 119.2,61.52 122.24,61.52 123.32,62.6 H3.4
$2N2410: length 9.5
  Top Layer w0.254: U13.78 118.12,65.14 119.2,64.06 122.24,64.06 123.32,65.14 H3.3
$2N2412: length 9.5
  Top Layer w0.254: U13.79 120.27,67.68 121.35,66.6 122.24,66.6 123.32,67.68 H3.2
$2N2414: length 9.5
  Top Layer w0.254: H3.1 123.32,70.22 122.24,69.14 121.35,69.14 120.27,70.22 U13.80
$2N2537: length 2.3
  Top Layer w0.254: R4.1 75.95,21.11 75.94,21.09
$2N3833: length 2.3
  Top Layer w0.254: CN26.1 80.65,7.54 R5.1
$2N5612: length 47.9
  Top Layer w0.254: D13.1 138.46,34.69 v1(138.81,35.04) ; 138.72,53.46 138.81,53.36 v1(138.81,52.19) ; D9.2 138.02,56.38 v1(138.05,56.38)
  Top Layer w1: U14.2 152.53,53.46 153.29,54.22 CN31.1
  Bottom Layer w0.254: v1(138.81,35.04) v1(138.81,52.19) 138.05,52.95 v1(138.05,56.38)
$2N5623: length 53.2
  Top Layer w0.254: D10.2 140.46,56.76 v1(142.11,55.11) ; v1(141.6,35.3) 141.32,35.3 D14.1
  Top Layer w1: CN31.2 153.29,56.76 151.57,55.04 136.64,55.04 136.57,55.11 135.21,55.11 135.14,55.04 134.68,55.04 131.83,52.19 U14.3
  Bottom Layer w0.254: v1(141.6,35.3) 141.6,54.6 v1(142.11,55.11)
$2N5632: length 50.6
  Top Layer w0.254: v1(144.53,56.12) 144.53,56.5 144.05,56.98 D11.2 ; D15.1 143.76,36.52 143.72,36.56
  Top Layer w1: CN32.1 153.29,45.84 153.29,45.2 144.65,36.56 143.72,36.56 143.47,36.31 134.11,36.31 131.19,39.23 131.06,39.23 U14.13
  Bottom Layer w0.254: v1(144.53,56.12) 144.53,54.6 153.29,45.84
$2N5638: length 45.4
  Top Layer w0.254: v1(147.96,56.25) 147.22,56.98 D12.2 ; D16.1 146.69,36.31 v1(146.94,36.56) ; v1(146.3,39.99) 145.86,40.43 145.86,40.95
  Top Layer w1: U14.14 143.13,38.22 153.29,48.38 CN32.2
  Bottom Layer w0.254: 153.29,48.38 153.29,50.92 v1(147.96,56.25) ; v1(146.94,36.56) 146.94,39.36 v1(146.3,39.99)
$2N5825: length 53.6
  Top Layer w0.254: D13.2 D14.2 D15.2 D16.2 147.67,32.34 148.84,33.52 148.84,38.34 153.29,42.79 159.26,42.79 160.78,44.31 160.78,49.65 160.27,50.15 151.51,50.15 147.98,46.63 C5.2
$2N6593: length 46.2
  Top Layer w0.254: C6.2 160.5,69.11 161.8,67.81 161.8,63.87 160.15,62.22 147.73,62.22 D24.2 D23.2 137.41,61.05 D21.2
$2N6599: length 54.8
  Top Layer w0.254: 143.51,77.33 145.54,79.36 D18.2 ; 143.38,77.46 143.38,77.33 v1(142.24,76.19) ; v1(141.73,63.36) 141.63,63.26 D22.1
  Top Layer w1: 152.31,75.17 151.71,75.77 145.46,75.77 136.58,84.64 134.31,84.64 133.6,83.94 133.6,82.67 132.21,81.27 130.94,81.27 130.18,80.51 ; CN33.2 153.42,75.17 ; 153.16,75.17 153.29,75.17
  Bottom Layer w0.254: v1(141.73,63.36) 141.73,75.68 v1(142.24,76.19)
$2N6609: length 47.1
  Top Layer w0.254: 151.08,67.25 151,67.32 v1(151,68.44) ; v1(150.24,77.71) 151.51,78.98 D20.2 ; D24.1 148.37,63.39 v1(148.46,63.49)
  Top Layer w1: CN34.2 CN34.2 152.7,67.25 135.97,67.25 U15.14
  Bottom Layer w0.254: v1(150.24,77.71) 150.24,69.33 151,68.57 v1(151,68.44) ; v1(148.46,63.49) 151.51,66.54 CN34.2
$2N6617: length 48.5
  Top Layer w0.254: v1(140.34,77.59) 140.34,76.92 139.65,76.24 ; D17.2 142.62,80.38 v1(142.75,80.25) ; D21.1 137.38,63.36 v1(138.3,63.36) ; v1(140.59,72.89) 140.59,73.95 141.26,74.63
  Top Layer w1: U15.2 134.94,81.46 135.14,81.26 135.57,81.26 136.91,79.92 136.91,78.98 141.54,74.35 149.92,74.35 151.96,72.32 152.97,72.32 153.29,72.63 158.37,72.63
  Bottom Layer w0.254: v1(140.34,77.59) 140.34,77.84 v1(142.75,80.25) ; v1(140.59,72.89) 138.3,70.6 v1(138.3,63.36)
$2N6627: length 49.1
  Top Layer w0.254: D23.1 144.47,64.35 144.47,64.76 ; v1(146.56,65.9) 146.05,65.39 146.05,65.01 ; D19.2 v1(148.46,78.35)
  Top Layer w1: U15.13 131.06,67.81 134.11,64.76 152.65,64.76 CN34.1 CN34.1
  Bottom Layer w0.254: v1(148.46,78.35) 148.46,67.81 v1(146.56,65.9)

## Copper pours and planes (outline as drawn; the poured copper is in the pictures)
GND on Top Layer: 73.28,22.72 71.25,20.69 71.25,15.61 71.88,14.97 119.13,14.97 121.28,17.13 121.28,26.53 118.75,29.07 118.75,29.45 81.53,29.45 81.41,29.58 78.87,27.04 78.87,22.98 78.49,22.59 73.41,22.59
GND on Bottom Layer: 0,88 164.82,88 164.82,0 0,0
VCC on Top Layer: 0,88 165,88 165,0 0,0

## Text on the board
Top Silkscreen Layer: 14 | GND | 12V | S2R | S2L | SDA | A7 | SCL | D2 | S1R | S1L | S | 12V led | ServoMotor2 | S(58) | ServoMotor1 | S(71) | nano / RST | all / RST | mega / RST | 3.3V | 5V
